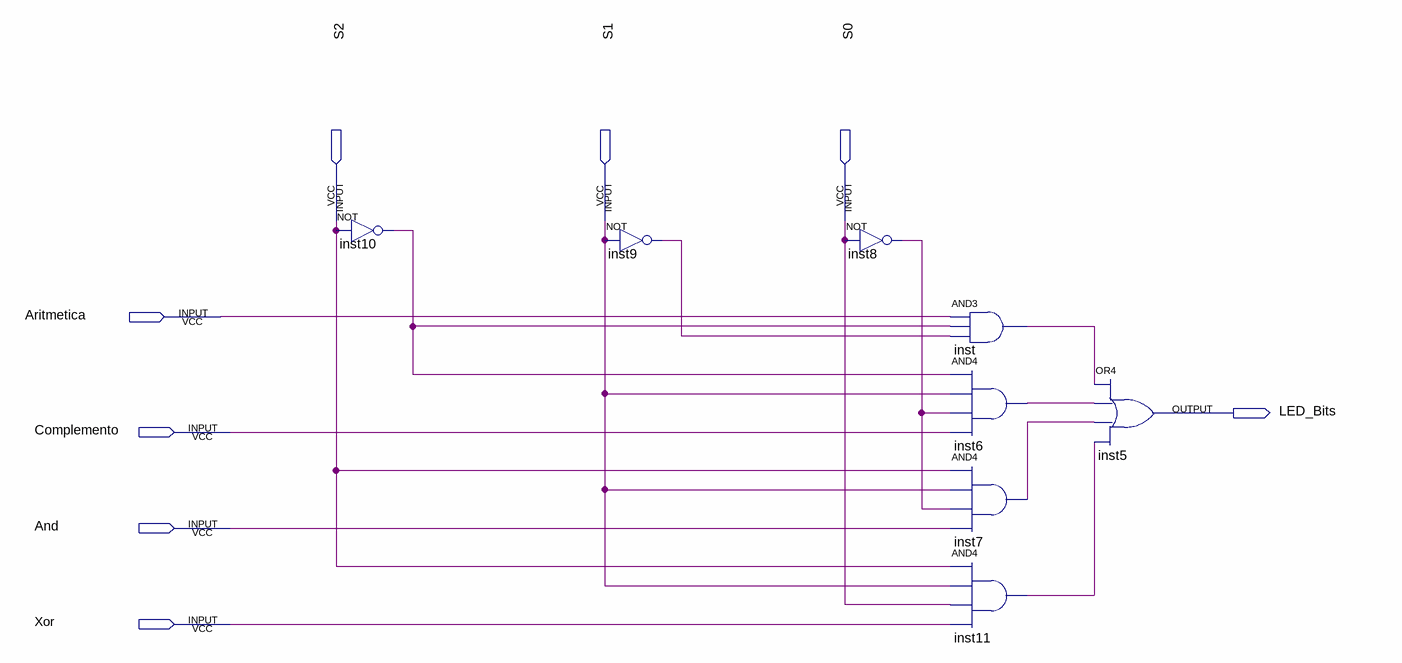
[diagram p0: schematic sheet]
// Quartus schematic Selec_Leds.bdf as structural Verilog: 8 symbols, 8 pins
module Selec_Leds (
  input  S2,
  input  S1,
  input  S0,
  input  Aritmetica,
  input  Complemento,
  input  And,
  input  Xor,
  output LED_Bits
);

  wire inst6_out, inst7_out, inst8_out, inst9_out, inst10_out, inst11_out, inst_out;

  not inst10 (inst10_out, S2);
  not inst9 (inst9_out, S1);
  not inst8 (inst8_out, S0);
  and inst (inst_out, Aritmetica, inst10_out, inst9_out);
  and inst6 (inst6_out, inst10_out, S1, inst8_out, Complemento);
  and inst7 (inst7_out, S2, S1, inst8_out, And);
  and inst11 (inst11_out, S2, S1, S0, Xor);
  or inst5 (LED_Bits, inst_out, inst6_out, inst7_out, inst11_out);
endmodule
